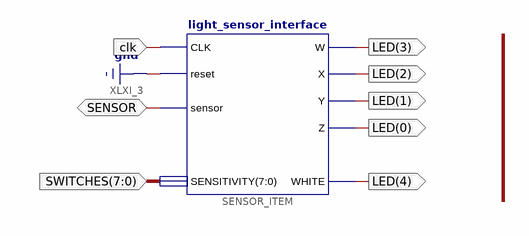
[diagram p0: schematic sheet 1]
// Xilinx ISE schematic example_circuit.sch (spartan3e) as structural Verilog: 1 symbols, 8 ports
module example_circuit (
  input  clk,
  input  [7:0] SWITCHES,
  inout  SENSOR,
  output [4:0] LED
);

  light_sensor_interface SENSOR_ITEM (
    .CLK(clk), .SENSITIVITY(SWITCHES), .W(LED[3]), .X(LED[2]), .Y(LED[1]), .Z(LED[0]), .sensor(SENSOR),
    .WHITE(LED[4]), .reset(1'b0));
endmodule
